# EAGLE design msp430_dip_breakout (EAGLE 7.5.0)
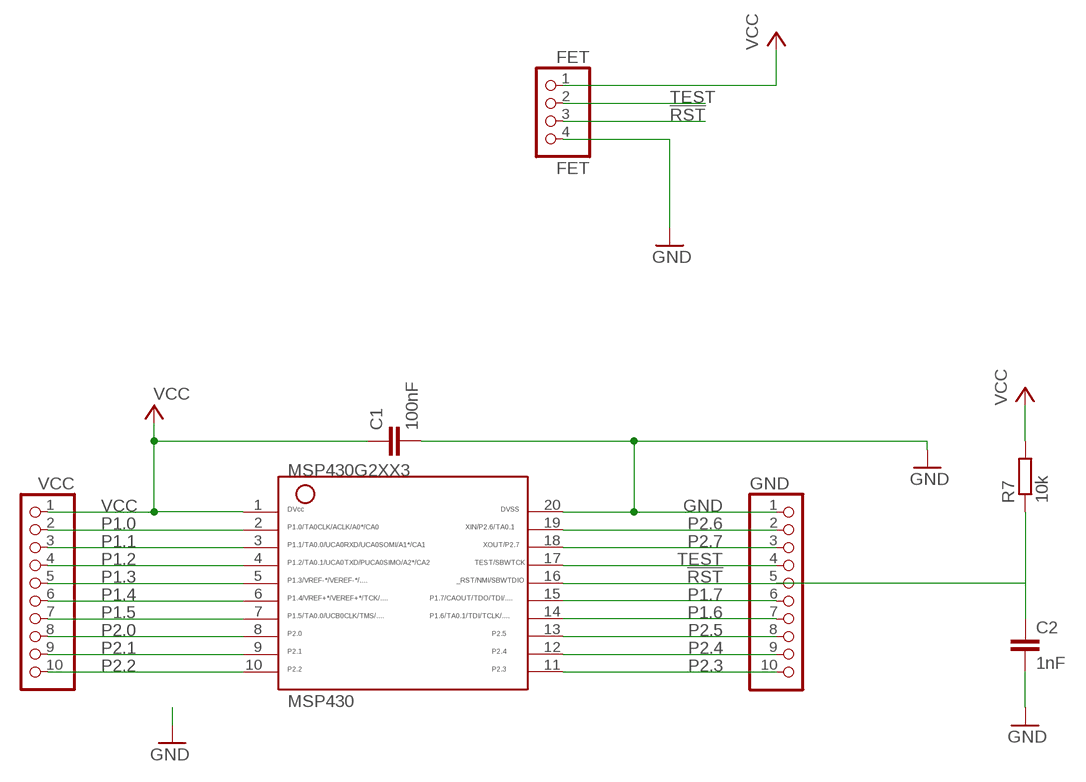
[diagram p0: schematic, sheet 1]

## Parts
C1  100nF  C-EUC0805  [C0805]
C2  1nF  C-EUC0805  [C0805]
FET  FET  PINHD-1X4  [1X04]
GND  PH1X10OCT076  [PH1X10OCT76]
MSP430  MSP430N  G2XX3---N20HEX  [DIP20_HEX]
R7  10k  R-EU_R0805  [R0805]
VCC  PH1X10OCT076  [PH1X10OCT76]

## Nets
!RST: C2.1 FET.3 GND.5 MSP430.16 R7.1
GND [GND]: C1.2 C2.2 FET.4 GND.1 MSP430.20
P1.0: MSP430.2 VCC.2
P1.1: MSP430.3 VCC.3
P1.2: MSP430.4 VCC.4
P1.3: MSP430.5 VCC.5
P1.4: MSP430.6 VCC.6
P1.5: MSP430.7 VCC.7
P1.6: GND.7 MSP430.14
P1.7: GND.6 MSP430.15
P2.0: MSP430.8 VCC.8
P2.1: MSP430.9 VCC.9
P2.2: MSP430.10 VCC.10
P2.3: GND.10 MSP430.11
P2.4: GND.9 MSP430.12
P2.5: GND.8 MSP430.13
P2.6: GND.2 MSP430.19
P2.7: GND.3 MSP430.18
TEST: FET.2 GND.4 MSP430.17
VCC [VCC]: C1.1 FET.1 MSP430.1 R7.2 VCC.1

## Library data of the parts
C1 C2 = rcl:C-EU: CAPACITOR, European symbol
FET = pinhead:PINHD-1X4: PIN HEADER
GND VCC = MY_CONN:PH1X10
MSP430 = TI_MSP430_v16:G2XX3---N20: MSP430G2XX1 PDIP (N) 20 Pin Package
R7 = resistor:R-EU_: RESISTOR, European symbol

## Net classes
0 default: width 0.406 mm, drill 0.508 mm
1 GND: width 0.508 mm, drill 0.508 mm
2 VCC: width 1.016 mm, drill 0.508 mm
4 VCCEXT: width 0.762 mm, drill 0.508 mm, clearance 0.229 mm

## Board
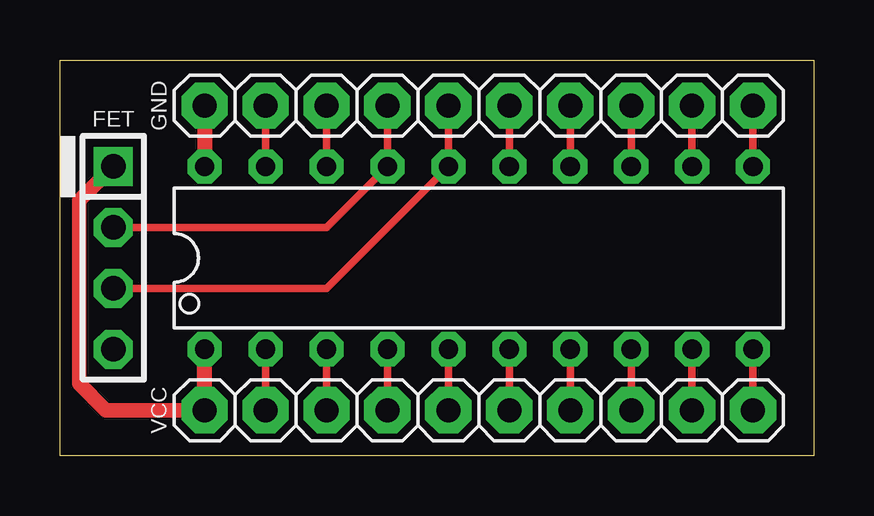
[diagram p1: board, top side]
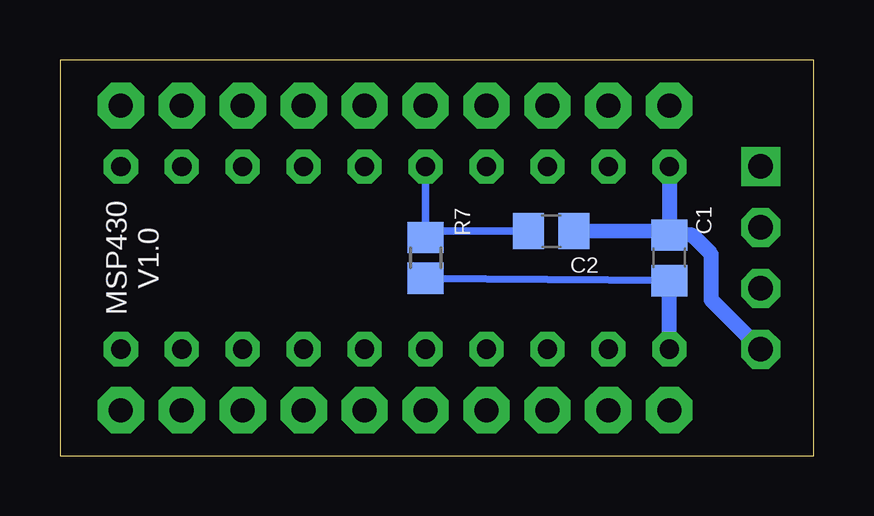
[diagram p2: board, bottom side, seen from below]

Size 31.43 x 16.51 mm. Coordinates in mm from the lower left corner, seen from the top.
Outline: 0,16.51 31.43,16.51 31.43,0 0,0 0,16.51
Copper layers (1*16): Top 0.035mm / dielectric 1.5mm / Bottom 0.035mm
Design rules "SparkFun": minimum track width 8mil, minimum drill 20mil, track to track 8mil, track to pad 8mil, pad to pad 8mil, via to via 8mil, smd to smd 8mil, copper to edge 10mil, drill to drill 8mil, minimum pad ring 12mil, minimum via ring 10mil, stop-mask expansion 4mil, vias tented up to drill 25mil, thermal gap 10mil

### Footprints (pad centres in the part's own frame; a part is rotated, then mirrored left to right if it is on the bottom)
C0805 = smd 1.3 x 1.5: 1 -0.95,0; 2 0.95,0
1X04 = drill 1.016 square: 1 -3.81,0 | drill 1.016 octagon: 2 -1.27,0; 3 1.27,0; 4 3.81,0
PH1X10OCT76 = drill 1 pad 1.93 octagon: 1 0,0; 2 2.54,0; 3 5.08,0; 4 7.62,0; 5 10.16,0; 6 12.7,0; 7 15.24,0; 8 17.78,0; 9 20.32,0; 10 22.86,0
DIP20_HEX = drill 0.8 pad 1.422 octagon: 1 -10.16,-3.81; 2 -7.62,-3.81; 3 -5.08,-3.81; 4 -2.54,-3.81; 5 0,-3.81; 6 2.54,-3.81; 7 5.08,-3.81; 8 7.62,-3.81; 9 10.16,-3.81; 10 12.7,-3.81; 11 12.7,3.81; 12 10.16,3.81; 13 7.62,3.81; 14 5.08,3.81; 15 2.54,3.81; 16 0,3.81; 17 -2.54,3.81; 18 -5.08,3.81; 19 -7.62,3.81; 20 -10.16,3.81
R0805 = smd 1.3 x 1.5: 1 -0.85,0; 2 0.85,0

### Placement (x,y rotation side)
C1  6.03,8.26 90 bottom
C2  10.95,9.37 0 bottom
FET  2.22,8.26 270 top
GND  6.03,14.61 0 top
MSP430  16.19,8.26 0 top
R7  16.19,8.26 270 bottom
VCC  6.03,1.91 0 top

### Tracks (layer width: path | path; a pad name or v marks a point on that pad's centre or on a via)
!RST
  Top 0.305: GND.5 MSP430.16 11.11,6.98 FET.3
  Bottom 0.305: MSP430.16 R7.1 | C2.1 15.93,9.37
  Bottom 0.406: 16.29,9.2 R7.1 15.93,9.37
GND
  Top 0.635: GND.1 MSP430.20
  Bottom 0.406: 6.19,9.37 C1.2
  Bottom 0.61: C2.2 6.19,9.37
  Bottom 0.635: MSP430.20 C1.2 5.08,9.2 4.29,8.41 4.29,6.51 FET.4
P1.0
  Top 0.305: VCC.2 MSP430.2
P1.1
  Top 0.305: VCC.3 MSP430.3
P1.2
  Top 0.305: MSP430.4 VCC.4
P1.3
  Top 0.305: VCC.5 MSP430.5
P1.4
  Top 0.305: MSP430.6 VCC.6
P1.5
  Top 0.305: VCC.7 MSP430.7
P1.6
  Top 0.305: GND.7 MSP430.14
P1.7
  Top 0.305: GND.6 MSP430.15
P2.0
  Top 0.305: VCC.8 MSP430.8
P2.1
  Top 0.305: VCC.9 MSP430.9
P2.2
  Top 0.305: VCC.10 MSP430.10
P2.3
  Top 0.305: GND.10 MSP430.11
P2.4
  Top 0.305: GND.9 MSP430.12
P2.5
  Top 0.305: GND.8 MSP430.13
P2.6
  Top 0.305: GND.2 MSP430.19
P2.7
  Top 0.305: GND.3 MSP430.18
TEST
  Top 0.305: GND.4 MSP430.17 11.11,9.52 FET.2
VCC
  Top 0.61: FET.1 0.79,10.64 0.79,3.02 1.9,1.91 VCC.1
  Top 0.635: VCC.1 MSP430.1
  Bottom 0.305: R7.2 C1.1
  Bottom 0.635: MSP430.1 C1.1

### Text on the board
bNames: MSP430 / V1.0